# EAGLE design WiFire (EAGLE 7.2.0)

## Sheet 1 of 2
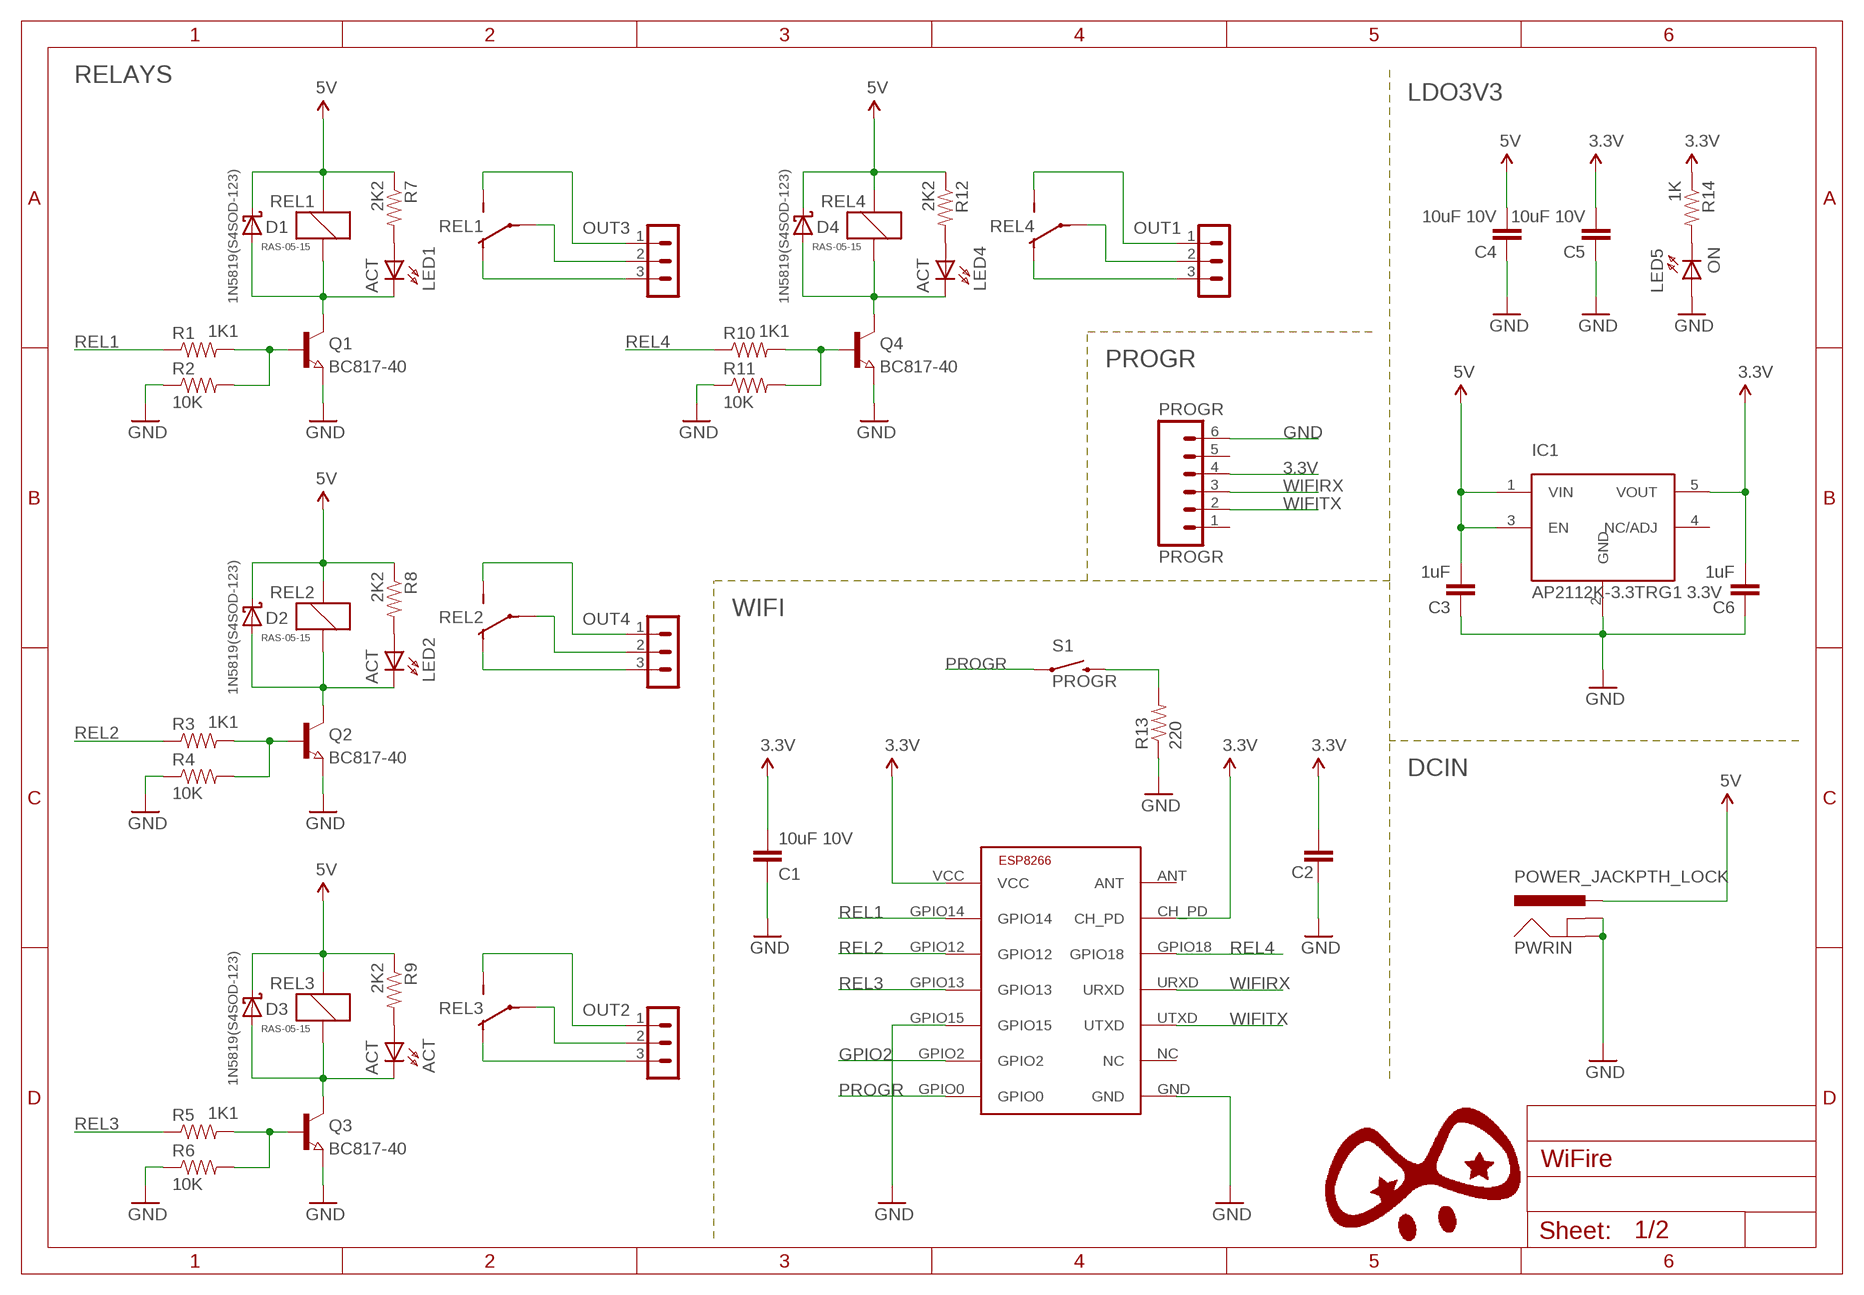
[diagram p0: schematic, sheet 1]

### Parts
ACT  ACT  LED0603DWS_L  [LED-0603_L]
C1  10uF 10V  CAP0402-CAP  [0402-CAP]
C2  0.1uF  CAP0402-CAP  [0402-CAP]
C3  1uF  CAP0402-CAP  [0402-CAP]
C4  10uF 10V  CAP0402-CAP  [0402-CAP]
C5  10uF 10V  CAP0402-CAP  [0402-CAP]
C6  1uF  CAP0402-CAP  [0402-CAP]
D1  1N5819(S4SOD-123)  SCHOTKKY7.62SS-1N5819(S4SOD-123)  [SOD-123]
D2  1N5819(S4SOD-123)  SCHOTKKY7.62SS-1N5819(S4SOD-123)  [SOD-123]
D3  1N5819(S4SOD-123)  SCHOTKKY7.62SS-1N5819(S4SOD-123)  [SOD-123]
D4  1N5819(S4SOD-123)  SCHOTKKY7.62SS-1N5819(S4SOD-123)  [SOD-123]
IC1  AP2112K-3.3TRG1 3.3V  5PIN_REG  [SOT23-5]
LED1  ACT  LED0603DWS_L  [LED-0603_L]
LED2  ACT  LED0603DWS_L  [LED-0603_L]
LED4  ACT  LED0603DWS_L  [LED-0603_L]
LED5  ON  LED0603DWS_L  [LED-0603_L]
OUT1  CON3-DG306-5.0_3P(TB3-5MM)  [DG306-5.0_3P]
OUT2  CON3-DG306-5.0_3P(TB3-5MM)  [DG306-5.0_3P]
OUT3  CON3-DG306-5.0_3P(TB3-5MM)  [DG306-5.0_3P]
OUT4  CON3-DG306-5.0_3P(TB3-5MM)  [DG306-5.0_3P]
PROGR  PROGR  M06SMD_MALE  [1X06_SMD_MALE]
PWRIN  POWER_JACKPTH_LOCK  [POWER_JACK_PTH_LOCK]
Q1  BC817-40  NPN-TRANSISTOR_SOT23  [SOT23]
Q2  BC817-40  NPN-TRANSISTOR_SOT23  [SOT23]
Q3  BC817-40  NPN-TRANSISTOR_SOT23  [SOT23]
Q4  BC817-40  NPN-TRANSISTOR_SOT23  [SOT23]
R1  1K1  RESISTOR0402-RES  [0402-RES]
R2  10K  RESISTOR0402-RES  [0402-RES]
R3  1K1  RESISTOR0402-RES  [0402-RES]
R4  10K  RESISTOR0402-RES  [0402-RES]
R5  1K1  RESISTOR0402-RES  [0402-RES]
R6  10K  RESISTOR0402-RES  [0402-RES]
R7  2K2  RESISTOR0402-RES  [0402-RES]
R8  2K2  RESISTOR0402-RES  [0402-RES]
R9  2K2  RESISTOR0402-RES  [0402-RES]
R10  1K1  RESISTOR0402-RES  [0402-RES]
R11  10K  RESISTOR0402-RES  [0402-RES]
R12  2K2  RESISTOR0402-RES  [0402-RES]
R13  220  RESISTOR0402-RES  [0402-RES]
R14  1K  RESISTOR0402-RES  [0402-RES]
REL1  RAS-05-15  RELAYH200F  [H200-FAT]
REL2  RAS-05-15  RELAYH200F  [H200-FAT]
REL3  RAS-05-15  RELAYH200F  [H200-FAT]
REL4  RAS-05-15  RELAYH200F  [H200-FAT]
S1  PROGR  SWITCH-MOMENTARY-2SIDE_EZ  [TACTILE-PTH-SIDEEZ]
U1  ESP8266  [ESP-03]

### Nets
3.3V: C1.2 C2.2 C5.2 C6.2 IC1.5(VOUT) PROGR.4 R14.1 U1.CH_PD U1.VCC
5V: C3.2 C4.2 D1.C D2.C D3.C D4.C IC1.1(VIN) IC1.3(EN) PWRIN.PWR R7.1 R8.1 R9.1 R12.1 REL1.1 REL2.1 REL3.1 REL4.1 ; also sheet 2
COM [REL]: OUT3.2 REL1.P(CONTACTS:P)
COM1 [REL]: OUT4.2 REL2.P(CONTACTS:P)
COM2 [REL]: OUT2.2 REL3.P(CONTACTS:P)
COM3 [REL]: OUT1.2 REL4.P(CONTACTS:P)
GND: C1.1 C2.1 C3.1 C4.1 C5.1 C6.1 IC1.2(GND) LED5.A PROGR.6 PWRIN.GND PWRIN.GNDBREAK Q1.2(E) Q2.2(E) Q3.2(E) Q4.2(E) R2.1 R4.1 R6.1 R11.1 R13.1 U1.GND U1.GPIO15 ; also sheet 2
GPIO2: U1.GPIO2
N$1: LED1.A R7.2
N$2: Q2.1(B) R3.2 R4.2
N$3 [pwr2]: D2.A LED2.C Q2.3(C) REL2.2
N$4: LED2.A R8.2
N$5: Q3.1(B) R5.2 R6.2
N$6 [pwr2]: ACT.C D3.A Q3.3(C) REL3.2
N$7: ACT.A R9.2
N$8: Q4.1(B) R10.2 R11.2
N$9 [pwr2]: D4.A LED4.C Q4.3(C) REL4.2
N$10: LED4.A R12.2
N$11: R13.2 S1.2
N$12: LED5.C R14.2
N$26: Q1.1(B) R1.2 R2.2
N$44 [pwr2]: D1.A LED1.C Q1.3(C) REL1.2
NC [REL]: OUT3.3 REL1.O(CONTACTS:O)
NC1 [REL]: OUT4.3 REL2.O(CONTACTS:O)
NC2 [REL]: OUT2.3 REL3.O(CONTACTS:O)
NC3 [REL]: OUT1.3 REL4.O(CONTACTS:O)
NO [REL]: OUT3.1 REL1.S(CONTACTS:S)
NO1 [REL]: OUT4.1 REL2.S(CONTACTS:S)
NO2 [REL]: OUT2.1 REL3.S(CONTACTS:S)
NO3 [REL]: OUT1.1 REL4.S(CONTACTS:S)
PROGR: S1.1 U1.GPIO0
REL1: R1.1 U1.GPIO14 ; also sheet 2
REL2: R3.1 U1.GPIO12 ; also sheet 2
REL3: R5.1 U1.GPIO13 ; also sheet 2
REL4: R10.1 U1.GPIO18
WIFIRX: PROGR.3 U1.URXD
WIFITX: PROGR.2 U1.UTXD
Unconnected: IC1.4(NC/ADJ) PROGR.1 PROGR.5 U1.ANT U1.NC

### Notes on the sheet
- RELAYS
- LDO3V3
- PROGR
- WIFI
- DCIN

## Sheet 2 of 2
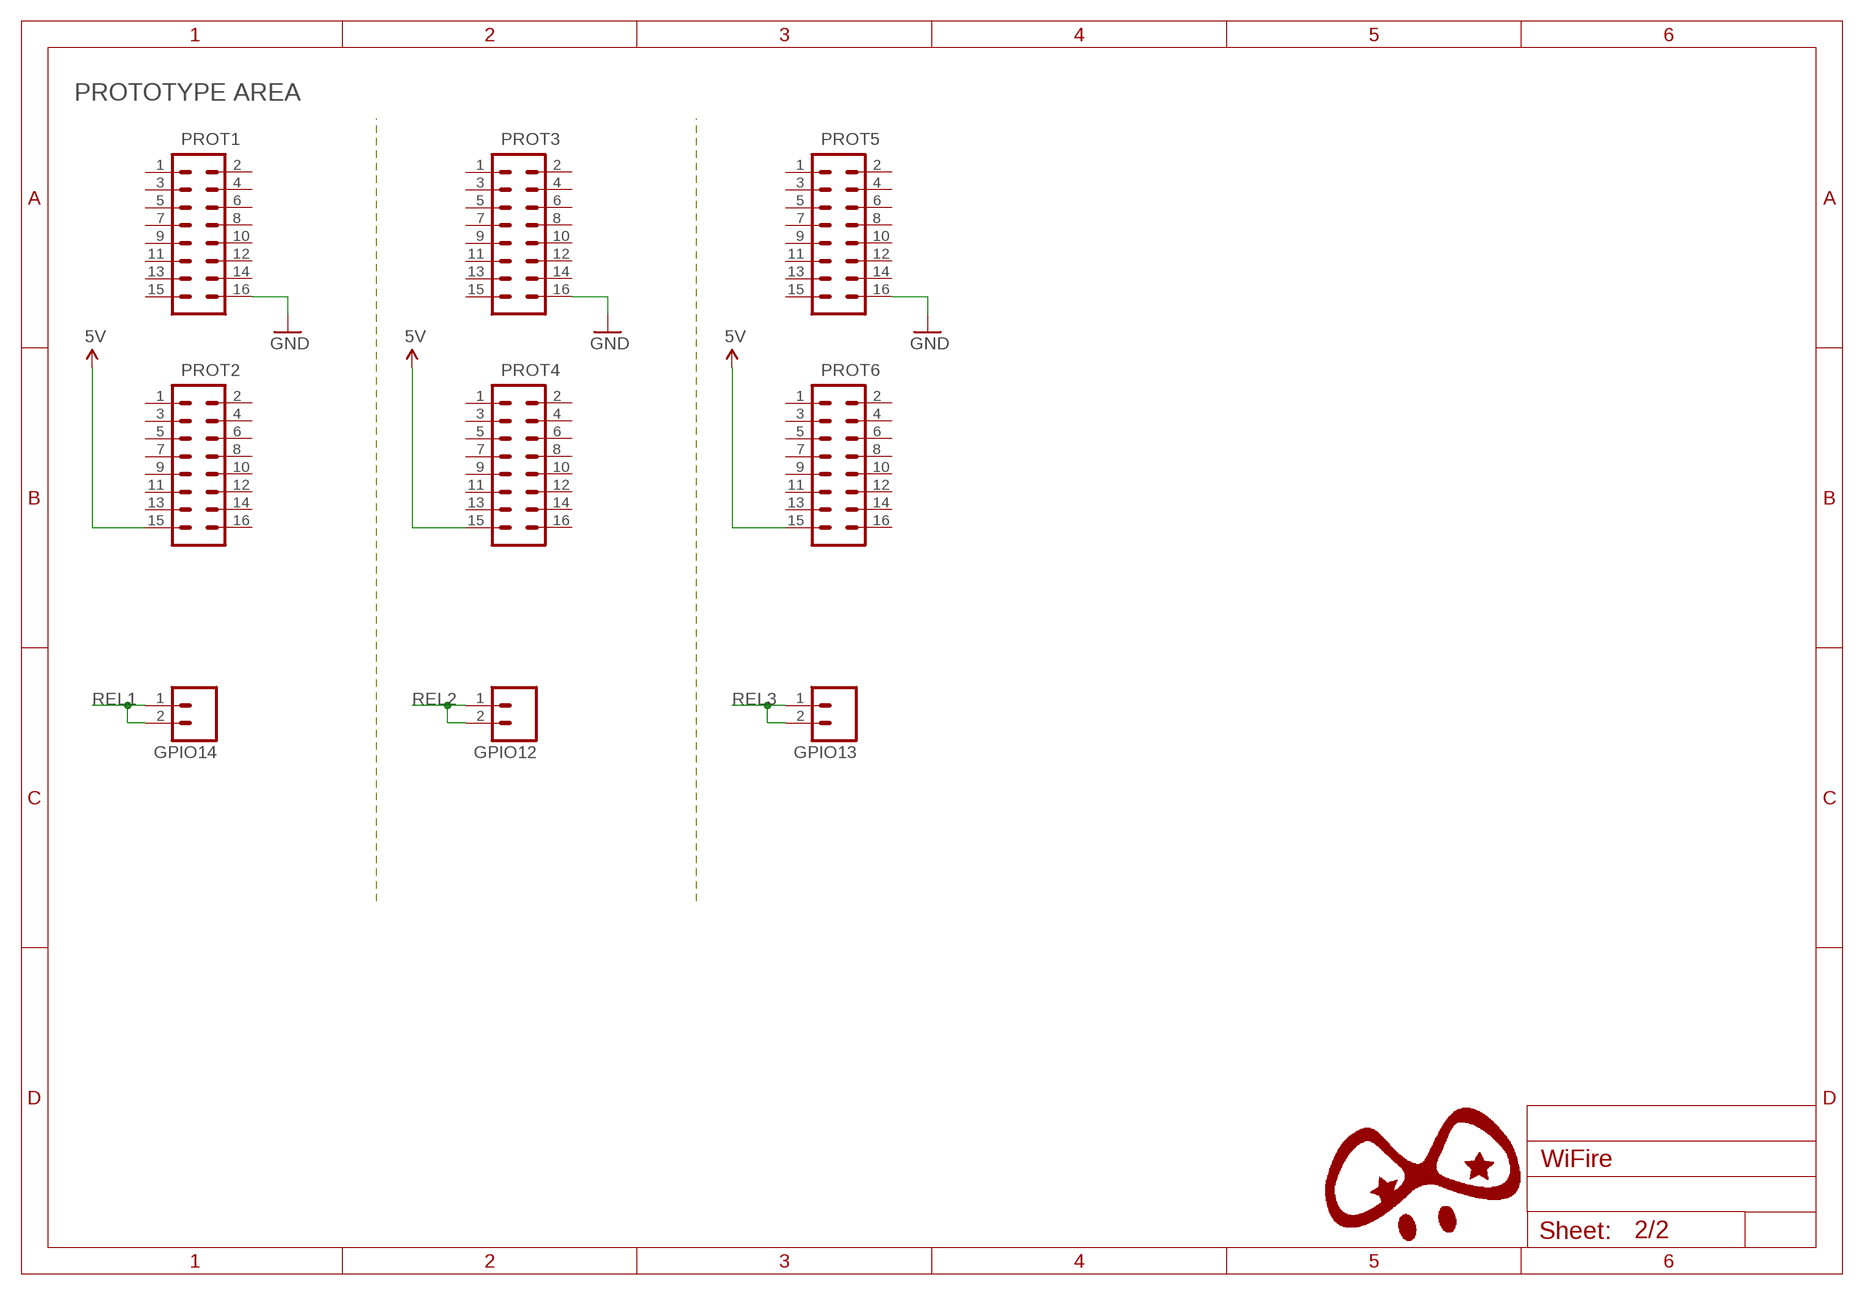
[diagram p1: schematic, sheet 2]

### Parts
GPIO12  M02PTH  [1X02]
GPIO13  M02PTH  [1X02]
GPIO14  M02PTH  [1X02]
PROT1  M08X2  [2X8]
PROT2  M08X2  [2X8]
PROT3  M08X2  [2X8]
PROT4  M08X2  [2X8]
PROT5  M08X2  [2X8]
PROT6  M08X2  [2X8]

### Nets
5V: PROT2.15 PROT4.15 PROT6.15 ; also sheet 1
GND: PROT1.16 PROT3.16 PROT5.16 ; also sheet 1
REL1: GPIO14.1 GPIO14.2 ; also sheet 1
REL2: GPIO12.1 GPIO12.2 ; also sheet 1
REL3: GPIO13.1 GPIO13.2 ; also sheet 1
Unconnected: PROT1.1 PROT1.2 PROT1.3 PROT1.4 PROT1.5 PROT1.6 PROT1.7 PROT1.8 PROT1.9 PROT1.10 PROT1.11 PROT1.12 PROT1.13 PROT1.14 PROT1.15 PROT2.1 PROT2.2 PROT2.3 PROT2.4 PROT2.5 PROT2.6 PROT2.7 PROT2.8 PROT2.9 PROT2.10 PROT2.11 PROT2.12 PROT2.13 PROT2.14 PROT2.16 PROT3.1 PROT3.2 PROT3.3 PROT3.4 PROT3.5 PROT3.6 PROT3.7 PROT3.8 PROT3.9 PROT3.10 PROT3.11 PROT3.12 PROT3.13 PROT3.14 PROT3.15 PROT4.1 PROT4.2 PROT4.3 PROT4.4 PROT4.5 PROT4.6 PROT4.7 PROT4.8 PROT4.9 PROT4.10 PROT4.11 PROT4.12 PROT4.13 PROT4.14 PROT4.16 PROT5.1 PROT5.2 PROT5.3 PROT5.4 PROT5.5 PROT5.6 PROT5.7 PROT5.8 PROT5.9 PROT5.10 PROT5.11 PROT5.12 PROT5.13 PROT5.14 PROT5.15 PROT6.1 PROT6.2 PROT6.3 PROT6.4 PROT6.5 PROT6.6 PROT6.7 PROT6.8 PROT6.9 PROT6.10 PROT6.11 PROT6.12 PROT6.13 PROT6.14 PROT6.16

### Notes on the sheet
- PROTOTYPE AREA

## Library data of the parts
ACT LED1 LED2 LED4 LED5 = DOUBLE-SIDE:LED
C1-C6 = SparkFun-Passives:CAP: Capacitor Standard 0603 ceramic capacitor, and 0.1" leaded capacitor.
D1-D4 = gogo:SCHOTKKY7.62SS
GPIO12-GPIO14 = SparkFun-Connectors:M02: Standard 2-pin 0.1" header. Use with - straight break away headers ( PRT-00116) - right angle break away headers (PRT-00553) - swiss pins (PRT-00743) - machine pins (PRT-00117) - female headers (PRT-00115) Molex polarized connector foot print use with: PRT-08233 with associated crimp pins and housings. 2.54_SCREWTERM for use with PRT-10571. 3.5mm Screw Terminal footprints for PRT-08084 5mm Screw Terminal footprints for use with PRT-08432
IC1 = GHI:5PIN_REG
OUT1-OUT4 = Penko:CON3
PROGR = SparkFun-Connectors:M06: Header 6 Standard 6-pin 0.1" header. Use with straight break away headers (SKU : PRT-00116), right angle break away headers (PRT-00553), swiss pins (PRT-00743), machine pins (PRT-00117), and female headers (PRT-00115). Molex polarized connector foot print use with SKU : PRT-08094 with associated crimp pins and housings. NOTES ON THE VARIANTS LOCK and LOCK_LONGPADS... This footprint was designed to help hold the alignment of a through-hole component (i.e. 6-pin header) while soldering it into place. You may notice that each hole has been shifted either up or down by 0.005 of an inch from it's more standard position (which is a perfectly straight line). This slight alteration caused the pins (the squares in the middle) to touch the edges of the holes. Because they are alternating, it causes a "brace" to hold the component in place. 0.005 has proven to be the perfect amount of "off-center" position when using our standard breakaway headers. Although looks a little odd when you look at the bare footprint, once you have a header in there, the alteration is very hard to notice. Also,if you push a header all the way into place, it is covered up entirely on the bottom side. This idea of altering the position of holes to aid alignment will be further integrated into the Sparkfun Library for other footprints. It can help hold any component with 3 or more connection pins.; PROD_ID: CONN-11293
PROT1-PROT6 = SparkFun-Connectors:M08X2: .1" headers, two rows of 8 each
PWRIN = SparkFun-Connectors:POWER_JACK: Power Jack This is the standard 5.5mm barrel jack for power. The PTH is the most common, proven, reliable, footprint. The Slot footprint only works if the mill layer is transmitted to the PCB fab house so be warned. Mating wall wart : TOL-00298 (and others); PROD_ID: CONN-08197; SF_ID: PRT-00119
Q1-Q4 = semicon-smd-ipc:NPN-TRANSISTOR_: NPN TRANSISTOR
R1-R14 = SparkFun-Passives:RESISTOR: Resistor Basic schematic elements and footprints for 0603, 1206, and PTH resistors.
REL1-REL4 = DOUBLE-SIDE:RELAY: RELAY
S1 = SparkFun-Electromechanical:SWITCH-MOMENTARY-2: Various NO switches- pushbuttons, reed, etc
U1 = ESP8266:ESP8266: low cost Wifi to Serial Module

## Net classes
0 default: width 0.254 mm, drill 0.254 mm, clearance 0.205 mm
2 pwr2: width 0.508 mm, clearance 0.205 mm
4 REL: width 1.676 mm, clearance 2.54 mm

## Board
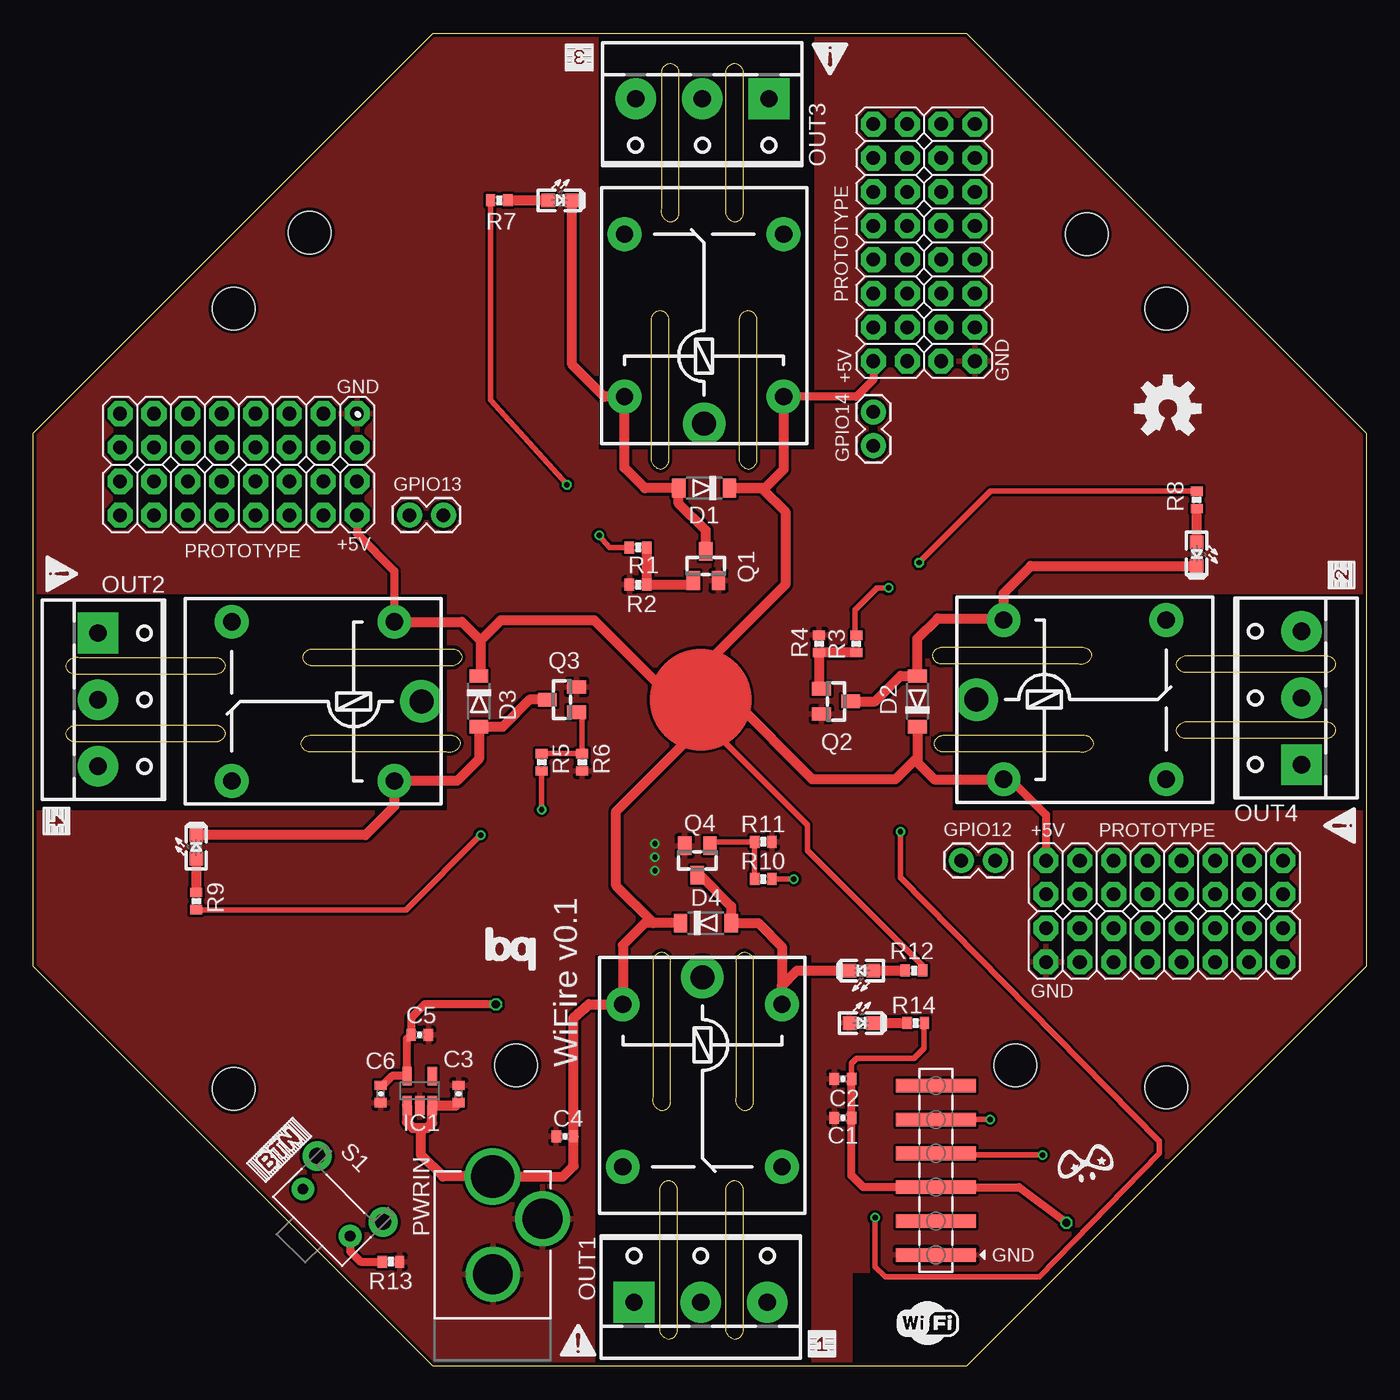
[diagram p2: board, top side]
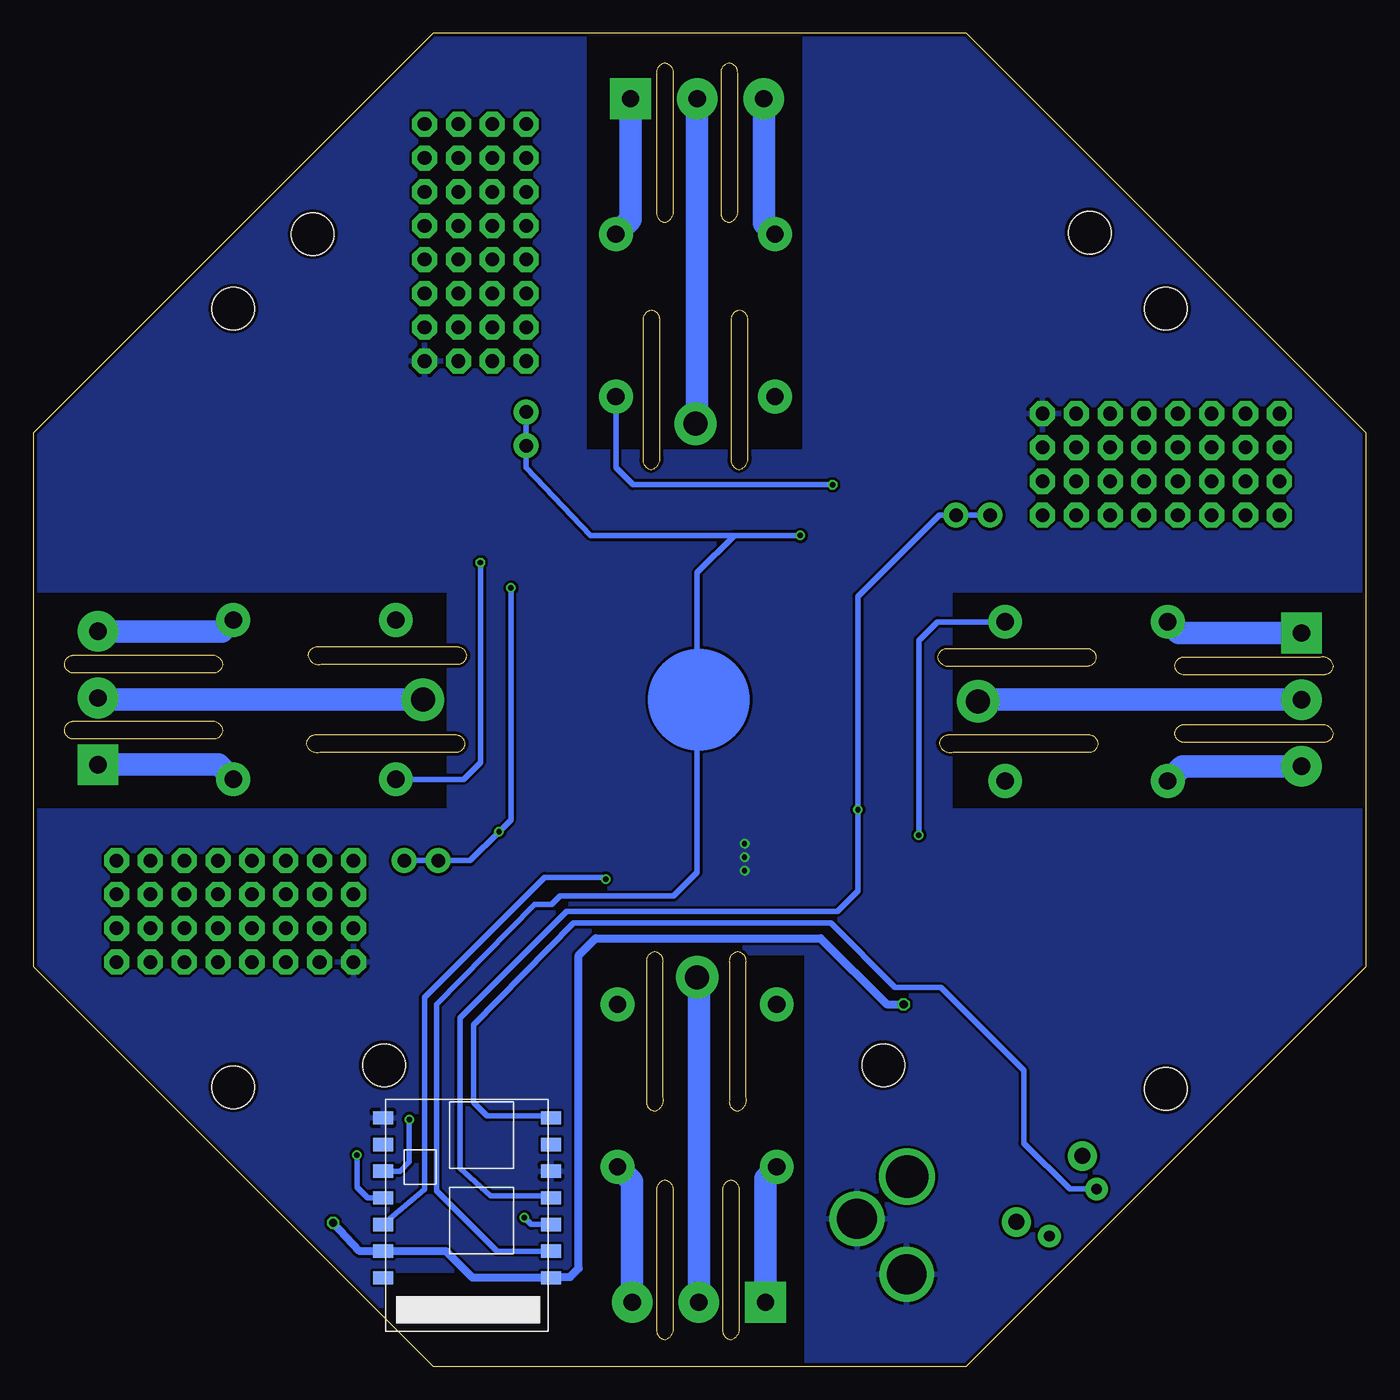
[diagram p3: board, bottom side, seen from below]

Size 100 x 100 mm. Coordinates in mm from the lower left corner, seen from the top.
Outline: 30,100 70,100 100,70 100,30 70,0 30,0 0,30 0,70 30,100
Outline: 2.45,52.55 arc-90 3.46,53.18 13.62,53.18 arc-90 14.38,52.55 arc-90 13.62,51.91 3.21,51.91 arc-90 2.45,52.55
Outline: 2.45,47.47 arc-90 3.46,48.1 13.62,48.1 arc-90 14.38,47.47 arc-90 13.62,46.83 3.21,46.83 arc-90 2.45,47.47
Outline: 85.76,52.67 arc-90 86.77,53.31 96.93,53.31 arc-90 97.7,52.67 arc-90 96.93,52.04 86.52,52.04 arc-90 85.76,52.67
Outline: 85.76,47.72 arc-90 86.77,48.35 96.93,48.35 arc-90 97.7,47.72 arc-90 96.93,47.08 86.52,47.08 arc-90 85.76,47.72
Outline: 47.78,85.82 arc-90 47.15,86.83 47.15,96.99 arc-90 47.78,97.76 arc-90 48.42,96.99 48.42,86.58 arc-90 47.78,85.82
Outline: 52.61,85.82 arc-90 51.98,86.83 51.98,96.99 arc-90 52.61,97.76 arc-90 53.25,96.99 53.25,86.58 arc-90 52.61,85.82
Outline: 47.66,2 arc-90 47.02,3.01 47.02,13.18 arc-90 47.66,13.94 arc-90 48.29,13.18 48.29,2.76 arc-90 47.66,2
Outline: 52.61,2 arc-90 51.98,3.01 51.98,13.18 arc-90 52.61,13.94 arc-90 53.25,13.18 53.25,2.76 arc-90 52.61,2
Outline: 47.02,67.28 arc-90 46.39,68.29 46.39,78.45 arc-90 47.02,79.21 arc-90 47.66,78.45 47.66,68.04 arc-90 47.02,67.28
Outline: 53.63,67.28 arc-90 52.99,68.29 52.99,78.45 arc-90 53.63,79.21 arc-90 54.26,78.45 54.26,68.04 arc-90 53.63,67.28
Outline: 79.41,53.31 arc-90 78.39,52.67 68.23,52.67 arc-90 67.47,53.31 arc-90 68.23,53.94 78.65,53.94 arc-90 79.41,53.31
Outline: 79.53,46.7 arc-90 78.52,46.07 68.36,46.07 arc-90 67.6,46.7 arc-90 68.36,47.34 78.77,47.34 arc-90 79.53,46.7
Outline: 32.16,53.18 arc-90 31.15,52.55 20.99,52.55 arc-90 20.23,53.18 arc-90 20.99,53.81 31.4,53.81 arc-90 32.16,53.18
Outline: 32.04,46.7 arc-90 31.02,46.07 20.86,46.07 arc-90 20.1,46.7 arc-90 20.86,47.34 31.27,47.34 arc-90 32.04,46.7
Outline: 47.15,19.14 arc-90 46.52,20.16 46.52,30.32 arc-90 47.15,31.08 arc-90 47.78,30.32 47.78,19.91 arc-90 47.15,19.14
Outline: 53.37,19.14 arc-90 52.74,20.16 52.74,30.32 arc-90 53.37,31.08 arc-90 54.01,30.32 54.01,19.91 arc-90 53.37,19.14
Copper layers (1*16): Top 0.035mm / dielectric 1.5mm / Bottom 0.035mm
Design rules "pighixxx_CAM_DRC_V1.0": minimum track width 6mil, minimum drill 12mil, track to track 6mil, track to pad 6mil, pad to pad 6mil, via to via 6mil, smd to smd 0mil, copper to edge 10mil, drill to drill 10mil, minimum pad ring 10mil, minimum via ring 6mil, stop-mask expansion 2mil, vias tented up to drill 100mil, thermal gap 10mil
Holes 3.2 mm at 15.02,20.8 15.02,79.34 20.73,85.06 79.03,84.93 85,79.34 85,20.92 36.23,22.57 73.69,22.57
tRestrict: area 61.5,0.2 to 73.7,7; area -2.6,41.8 to 31,57.9; area 42.2,-2.8 to 58.3,30.8; area 42.5,68.8 to 58.6,102.5; area 69,41.8 to 102.6,57.9
bRestrict: area 61.5,0.2 to 73.7,7; area 42.2,-2.8 to 58.3,30.8; area -2.6,41.9 to 31,58; area 42.3,68.8 to 58.5,102.5; area 69,41.9 to 102.6,58

### Footprints (pad centres in the part's own frame; a part is rotated, then mirrored left to right if it is on the bottom)
LED-0603_L = smd 1.016 x 1.016: A 0.889,0; C -0.889,0
0402-CAP = smd 0.7 x 0.9: 1 -0.65,0; 2 0.65,0
SOD-123 = smd 1 x 1.4: A 1.9,0; C -1.9,0
1X02 = drill 1.016 pad 1.88: 1 0,0; 2 2.54,0
SOT23-5 = smd 0.7 x 1.4: 1 0.95,1.1; 2 0,1.1; 3 -0.95,1.1; 4 -0.95,-1.1; 5 0.95,-1.1
DG306-5.0_3P = drill 1.3 pad 3.048 square: 1 -5,0 | drill 1.3 pad 3.048: 2 0,0; 3 5,0
1X06_SMD_MALE = smd 1.02 x 6: 1 0,0; 2 2.54,0; 3 5.08,0; 4 7.62,0; 5 10.16,0; 6 12.7,0
2X8 = drill 1.016 pad 1.88 octagon: 1 0,0; 2 0,2.54; 3 2.54,0; 4 2.54,2.54; 5 5.08,0; 6 5.08,2.54; 7 7.62,0; 8 7.62,2.54; 9 10.16,0; 10 10.16,2.54; 11 12.7,0; 12 12.7,2.54; 13 15.24,0; 14 15.24,2.54; 15 17.78,0; 16 17.78,2.54
POWER_JACK_PTH_LOCK = drill 2.997 pad 4.115: GND 0.025,6.557; GNDBREAK 3.762,10.7 | drill 3.2 pad 4.115: PWR 0,13.878
SOT23 = smd 1.4 x 1: 1 1.1,-0.95; 2 1.1,0.95; 3 -1.1,0
0402-RES = smd 0.7 x 0.9: 1 -0.65,0; 2 0.65,0
H200-FAT = drill 1.295 pad 2.54: 1 -7.493,-5.969; 2 -7.493,5.969; O 4.699,5.969; S 4.699,-5.969 | drill 1.803 pad 3.175: P -9.525,0
TACTILE-PTH-SIDEEZ = drill 0.8 pad 1.7: 1 -2.5,0; 2 2.5,0 | drill 1.2 pad 2.2: ANCHOR1 -3.5,2.5; ANCHOR2 3.5,2.5
ESP-03 = smd 1 x 1.5: ANT 4,12.4; CH_PD 6,12.4; GND 16,12.4; GPIO0 16,-0.2; GPIO2 14,-0.2; GPIO12 8,-0.2; GPIO13 10,-0.2; GPIO14 6,-0.2; GPIO15 12,-0.2; GPIO18 8,12.4; NC 14,12.4; URXD 10,12.4; UTXD 12,12.4; VCC 4,-0.2

### Placement (x,y rotation side)
ACT  12.22,38.96 270 top
C1  60.74,18.64 0 top
C2  60.74,21.56 0 top
C3  31.91,20.41 270 top
C4  39.89,17.24 0 top
C5  28.99,24.86 180 top
C6  26.07,20.41 90 top
D1  50.33,65.88 180 top
D2  66.33,49.88 90 top
D3  33.43,49.88 270 top
D4  50.45,33.24 0 top
GPIO12  69.63,37.94 0 top
GPIO13  28.23,63.85 0 top
GPIO14  63.03,69.05 90 top
IC1  28.99,20.67 180 top
LED1  39.53,87.47 180 top
LED2  87.28,60.93 90 top
LED4  62.14,29.69 0 top
LED5  62.14,25.75 180 top
OUT1  50.07,4.79 0 top
OUT2  4.86,50.01 270 top
OUT3  50.2,95.09 180 top
OUT4  95.16,50.13 90 top
PROGR  67.72,21.05 270 top
PROT1  6.51,68.93 0 top
PROT2  6.51,63.85 0 top
PROT3  93.76,32.86 180 top
PROT4  93.76,37.94 180 top
PROT5  68.11,93.18 270 top
PROT6  63.03,93.18 270 top
PWRIN  34.45,0.35 0 top
Q1  50.45,60.04 270 top
Q2  60.23,49.88 180 top
Q3  39.66,50.01 0 top
Q4  49.82,37.94 90 top
R1  45.37,61.44 0 top
R2  45.37,58.64 0 top
R3  61.75,54.2 270 top
R4  58.96,54.2 270 top
R5  38.13,45.31 90 top
R6  41.18,45.31 90 top
R7  34.96,87.47 0 top
R8  87.28,64.99 270 top
R9  12.22,34.89 90 top
R10  54.77,36.54 180 top
R11  54.77,39.34 180 top
R12  66.07,29.69 180 top
R13  26.83,7.84 180 top
R14  66.2,25.75 180 top
REL1  50.33,80.23 90 top
REL2  80.3,50.01 0 top
REL3  19.59,49.88 180 top
REL4  50.2,19.65 270 top
S1  22,11.52 315 top
U1  61.37,2.63 90 bottom
U$1  [BQ_LOGO_MEDIUM]  33.94,29.69 0 top
U$2  [S_1]  58.2,0.73 0 top
U$3  [S_2]  99.09,58.39 90 top
U$4  [S_3]  41.94,99.15 180 top
U$5  [S_4]  0.79,41.88 270 top
U$6  [S_ATTENTION]  39.4,0.6 0 top
U$7  [OSHW-LOGO-M]  85.12,71.85 0 top
U$8  [S_WIFI]  64.8,1.62 0 top
U$9  [S_BTN]  16.04,15.21 315 top
U$10  [S_ATTENTION]  99.35,39.08 90 top
U$11  [S_ATTENTION]  61.25,99.41 180 top
U$12  [S_ATTENTION]  0.79,60.93 270 top
U$13  [PIGHIXXX_LOGO]  76.87,13.81 0 top

### Tracks (layer width: path | path; a pad name or v marks a point on that pad's centre or on a via)
3.3V  (via drill 0.6, 0.61)
  Top 0.406: C2.2 61.39,22.71 61.75,23.08 66.07,23.08 66.83,23.84 66.83,25.73 R14.1
  Top 0.61: v77.5,10.76 73.95,13.43 PROGR.4 62.26,13.43 61.37,14.32 61.37,18.62 C1.2 C2.2 | C5.2 28.04,24.56 IC1.5 28,21.81 26.96,21.81 26.21,21.06 C6.2 | 28.34,25.23 C5.2 | v34.7,27.14 29.37,27.14 28.35,26.13 28.35,24.87 C5.2
  Bottom 0.61: v77.5,10.76 75.5,8.63 U1.CH_PD 69.05,8.63 67.05,6.63 U1.VCC 61.11,6.7 59.72,6.7 59.09,7.33 59.09,30.83 57.82,32.1 40.93,32.1 35.97,27.14 v34.7,27.14
5V  (via drill 0.41)
  Top 0.406: R9.1 27.96,34.24 v33.56,39.84 | R7.1 34.31,72.5 v40.04,66.13 | R8.1 71.8,65.64 v66.45,60.29 | R12.1 66.72,30.05 58.07,38.7 58.07,40.61 51.47,47.21
  Top 0.61: 50.58,52.8 50.58,51.91 52.48,50.01 52.48,48.23 51.47,47.21 50.83,47.21 50.07,47.97 47.53,50.51 | PROT2.15 24.29,62.45 27.08,59.66 REL3.1 | REL2.1 73.31,44.04 75.98,41.37 PROT4.15 | PROT6.15 63.03,74.01 61.75,72.74 REL1.1
  Top 0.762: IC1.1 28.04,18.32 28.48,17.87 29.04,17.87 | 29.04,17.87 29.55,17.87 29.93,18.25 29.93,19.56 | 29.93,19.56 IC1.3 | 29.93,19.56 31.7,19.56 C3.2 | 29.04,17.87 29.09,17.82 29.09,15.87 30.73,14.23 PWRIN.PWR 36.77,14.23 39.71,14.22 40.55,15.02 C4.2 40.53,26.11 41.69,27.14 REL4.1 44.23,31.59 45.88,33.24 D4.C 46.52,33.24 43.72,36.04 43.72,41.62 50.07,47.97 | REL1.1 56.29,67.28 54.9,65.88 D1.C 54.64,65.88 56.42,64.1 56.42,58.64 50.58,52.8 | REL2.1 67.6,44.04 66.33,45.31 D2.C 66.33,45.69 64.68,44.04 58.45,44.04 52.48,50.01 | REL3.1 32.16,55.85 33.56,54.45 | 33.56,54.45 33.56,51.91 D3.C | 33.56,54.45 35.09,55.97 42.07,55.97 47.53,50.51
  Bottom 0.406: v33.56,39.84 33.56,54.45 32.16,55.85 REL3.1 | v40.04,66.13 55.02,66.13 56.29,67.4 REL1.1 | v66.45,60.29 66.45,45.31 67.72,44.04 REL2.1
COM
  Bottom 1.676: OUT3.2 50.2,70.83 REL1.P
COM1
  Bottom 1.676: REL2.P 95.03,50.01 OUT4.2
COM2
  Bottom 1.676: OUT2.2 28.99,50.01 REL3.P
COM3
  Bottom 1.676: OUT1.2 50.07,29.05 REL4.P
GND  (via drill 0.41)
  other vias: 46.64,39.21 46.64,38.19 46.64,37.18
  pour Bottom: -0.35,71.21 29.62,101.06 70.52,101.06 101.38,70.2 101.25,29.81 70.14,-1.18 29.37,-1.18 -0.98,29.05 -1.11,69.69 -0.22,71.09
  pour Top: -1.11,61.82 -0.98,70.45 29.88,101.31 70.64,101.06 101.76,69.56 101.51,28.92 70.26,-1.43 28.86,-1.68 -0.86,29.05 -1.11,56.48
N$1
  Top 0.762: R7.2 LED1.A
N$2
  Top 0.762: R3.2 R4.2 58.96,51 Q2.1
N$3
  Top 0.762: Q2.3 63.15,49.88 65.06,51.78 D2.A 66.33,54.58 67.85,56.1 72.68,56.1 REL2.2 72.8,58.01 74.84,60.04 LED2.C
N$4
  Top 0.762: LED2.A R8.2
N$5
  Top 0.406: Q3.1 41.18,48.63 R6.2 R5.2
N$6
  Top 0.762: Q3.3 37.24,50.01 35.21,47.97 D3.A 33.43,45.56 31.78,43.91 REL3.2 27.08,42 24.93,39.84 ACT.C
N$7
  Top 0.762: ACT.A R9.2
N$8
  Top 0.406: R10.2 R11.2 51.06,39.34 Q4.1
N$9
  Top 0.762: Q4.3 50.03,36.84 52.36,34.51 D4.A 54.39,33.24 56.17,31.46 REL4.2 56.17,28.54 57.31,29.69 LED4.C
N$10
  Top 0.762: LED4.A R12.2
N$11
  Top 0.61: S1.2 23.77,8.61 24.54,7.84 R13.2
N$12
  Top 0.762: LED5.C R14.2
N$26
  Top 0.762: R1.2 R2.2 49.2,58.64 Q1.1
N$44
  Top 0.762: Q1.3 50.45,62.7 48.42,64.74 D1.A 45.88,65.88 44.36,67.4 REL1.2 42.83,72.74 40.42,75.15 LED1.C
NC
  Bottom 1.676: OUT3.3 45.2,85.77 REL1.O
NC1
  Bottom 1.676: OUT4.3 85.84,55.13 REL2.O
NC2
  Bottom 1.676: OUT2.3 13.8,45.01 REL3.O
NC3
  Bottom 1.676: OUT1.3 55.07,13.86 REL4.O
NO
  Bottom 1.676: OUT3.1 55.2,86.03 REL1.S
NO1
  Bottom 1.676: OUT4.1 86.09,45.13 REL2.S
NO2
  Bottom 1.676: OUT2.1 14.05,55.01 REL3.S
NO3
  Bottom 1.676: OUT1.1 45.07,14.11 REL4.S
PROGR
  Bottom 0.406: U1.GPIO0 61.3,18.76 65.95,18.76 66.96,19.78 66.96,25.62 59.47,33.24 40.16,33.24 35.34,28.41 31.91,28.41 25.69,22.19 25.69,16.73 22.25,13.29 S1.1
REL1  (via drill 0.41)
  Top 0.406: R1.1 43.21,61.44 v42.45,62.32
  Bottom 0.406: U1.GPIO14 65.22,8.63 69.76,13.18 69.76,27.14 62.39,34.64 61.12,34.64 60.48,35.27 51.98,35.27 50.2,37.05 50.2,59.53 47.4,62.32 v42.45,62.32 58.2,62.32 63.03,67.4 GPIO14.1 GPIO14.2
REL2  (via drill 0.41)
  Top 0.406: v63.15,11.14 63.15,7.46 63.91,6.7 75.47,6.7 84.49,15.97 84.49,16.86 65.06,36.67 v65.06,40.1 | v64.17,58.39 63.28,58.39 61.63,56.74 61.63,54.97 R3.1
  Bottom 0.406: U1.GPIO12 62.64,10.63 v63.15,11.14 | v64.17,58.39 64.17,40.99 v65.06,40.1 67.22,37.94 GPIO12.1 GPIO12.2
REL3  (via drill 0.41)
  Top 0.406: v38.13,41.75 R5.1
  Bottom 0.406: U1.GPIO13 61.33,12.79 65.69,12.79 67.98,14.83 67.98,26.13 59.98,34.13 39.66,34.13 38.13,35.65 v38.13,41.75 38.13,57.75 32.04,63.85 GPIO13.2 GPIO13.1
REL4  (via drill 0.41)
  Top 0.406: v57.06,36.54 R10.1
  Bottom 0.406: U1.GPIO18 70.64,13.26 70.64,27.65 61.63,36.67 57.18,36.67 v57.06,36.54
WIFIRX  (via drill 0.41)
  Top 0.406: v75.72,15.84 67.85,15.84 PROGR.3
  Bottom 0.406: U1.URXD 74.93,12.63 75.72,13.43 v75.72,15.84
WIFITX  (via drill 0.41)
  Top 0.406: v71.79,18.51 PROGR.2
  Bottom 0.406: U1.UTXD 72.49,14.63 71.79,15.33 v71.79,18.51
(copper drawn outside any net)
  shapes: Bottom circle x2, Top circle x2

### Text on the board
tNames: PROTOTYPE | GND | GND | +5V | +5V | PROTOTYPE | PROTOTYPE | +5V | GND | WiFire v0.1 | GND